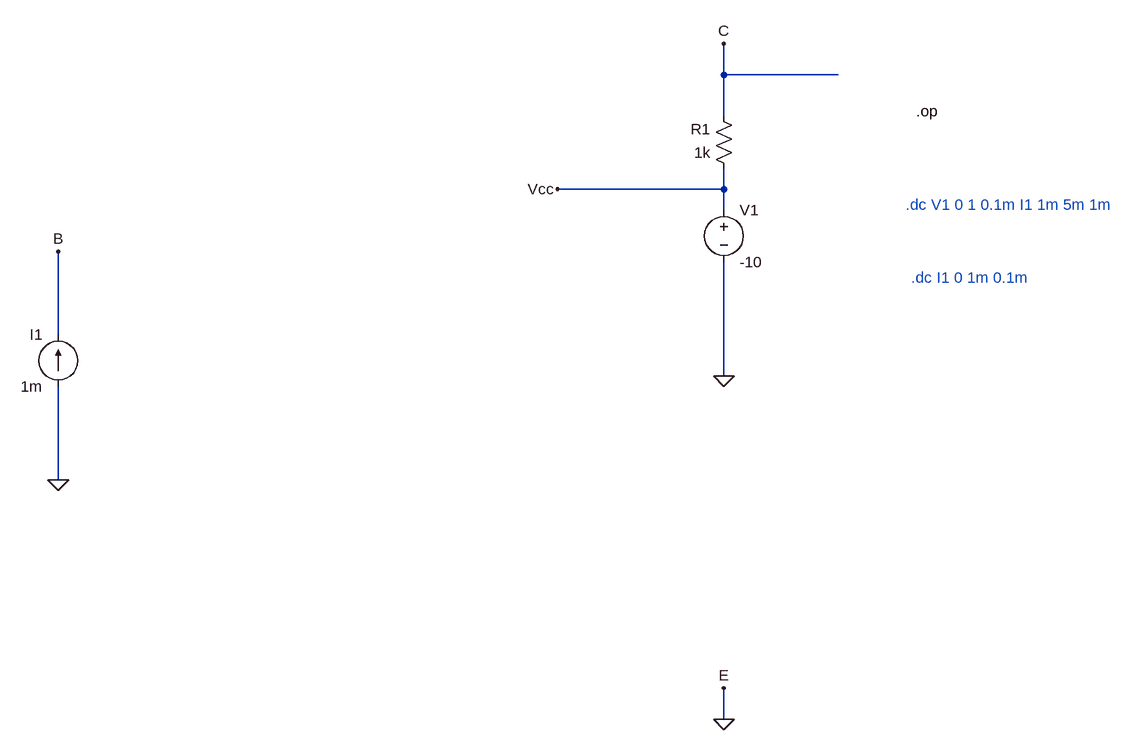
[diagram p0: schematic Draft2.asc]
Draft2.asc, the LTspice schematic file:
Version 4
SHEET 1 880 948
WIRE 80 -64 80 -112
WIRE 256 -64 80 -64
WIRE 80 0 80 -64
WIRE 80 112 80 80
WIRE 80 112 -176 112
WIRE 80 144 80 112
WIRE -944 336 -944 208
WIRE 80 400 80 224
WIRE -944 560 -944 416
WIRE 80 928 80 880
FLAG 80 400 0
FLAG 80 -112 C
FLAG -176 112 Vcc
FLAG 80 928 0
FLAG 80 880 E
FLAG -944 560 0
FLAG -944 208 B
DATAFLAG 208 -64 ""
SYMBOL voltage 80 128 R0
WINDOW 123 0 0 Left 0
WINDOW 39 0 0 Left 0
SYMATTR InstName V1
SYMATTR Value -10
SYMBOL res 96 96 R180
WINDOW 0 36 76 Left 2
WINDOW 3 36 40 Left 2
SYMATTR InstName R1
SYMATTR Value 1k
SYMBOL current -944 416 R180
WINDOW 0 24 80 Left 2
WINDOW 3 24 0 Left 2
WINDOW 123 0 0 Left 0
WINDOW 39 0 0 Left 0
SYMATTR InstName I1
SYMATTR Value 1m
TEXT 360 136 Left 2 ;.dc V1 0 1 0.1m I1 1m 5m 1m
TEXT 368 248 Left 2 ;.dc I1 0 1m 0.1m
TEXT 376 -8 Left 2 !.op

The netlist it stands for:
* Draft2.asc
V1 Vcc 0 -10
R1 Vcc C 1k
I1 0 B 1m
* .dc V1 0 1 0.1m I1 1m 5m 1m
* .dc I1 0 1m 0.1m
.op
.backanno
.end